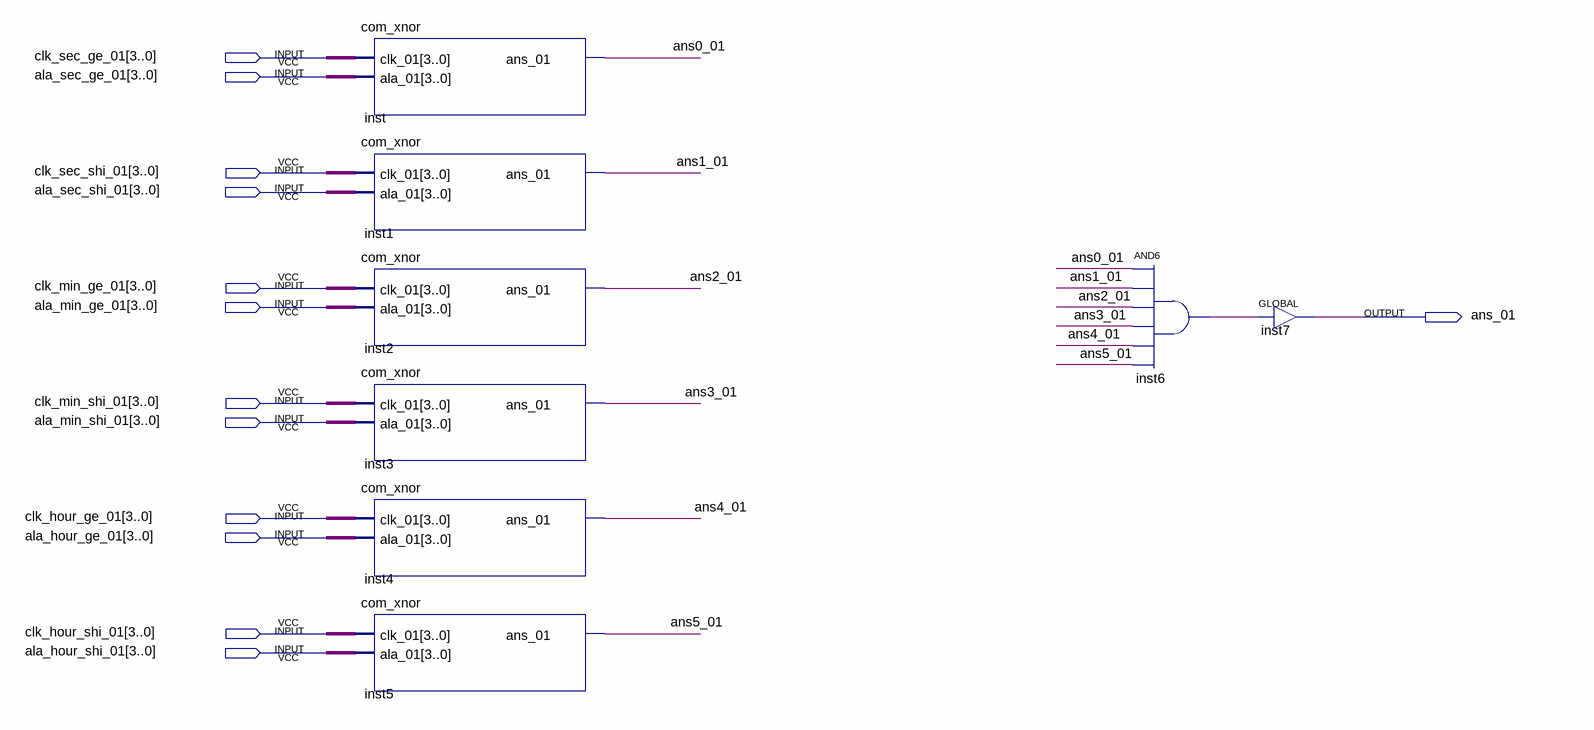
[diagram p0: schematic sheet]
// Quartus schematic compare.bdf as structural Verilog: 8 symbols, 13 pins
module compare (
  input  [3:0] clk_sec_ge_01,
  input  [3:0] ala_sec_ge_01,
  input  [3:0] clk_sec_shi_01,
  input  [3:0] ala_sec_shi_01,
  input  [3:0] clk_min_ge_01,
  input  [3:0] ala_min_ge_01,
  input  [3:0] clk_min_shi_01,
  input  [3:0] ala_min_shi_01,
  input  [3:0] clk_hour_ge_01,
  input  [3:0] ala_hour_ge_01,
  input  [3:0] clk_hour_shi_01,
  input  [3:0] ala_hour_shi_01,
  output ans_01
);

  wire ans0_01, ans1_01, ans2_01, ans3_01, ans4_01, ans5_01, inst6_out;

  com_xnor inst (.clk_01(clk_sec_ge_01), .ala_01(ala_sec_ge_01), .ans_01(ans0_01));
  com_xnor inst1 (.clk_01(clk_sec_shi_01), .ala_01(ala_sec_shi_01), .ans_01(ans1_01));
  com_xnor inst2 (.clk_01(clk_min_ge_01), .ala_01(ala_min_ge_01), .ans_01(ans2_01));
  com_xnor inst3 (.clk_01(clk_min_shi_01), .ala_01(ala_min_shi_01), .ans_01(ans3_01));
  com_xnor inst4 (.clk_01(clk_hour_ge_01), .ala_01(ala_hour_ge_01), .ans_01(ans4_01));
  com_xnor inst5 (.clk_01(clk_hour_shi_01), .ala_01(ala_hour_shi_01), .ans_01(ans5_01));
  and inst6 (inst6_out, ans0_01, ans1_01, ans2_01, ans3_01, ans4_01, ans5_01);
  GLOBAL inst7 (.IN(inst6_out), .OUT(ans_01));
endmodule
